# Altium schematic sheet main.SchDoc: Main
size A4; CheckedBy: rrodrigu; Author: Satxo; CompanyName: Satxo; Revision: 0v1; SheetNumber: 1; SheetTotal: 8; ProjectName: Basestation
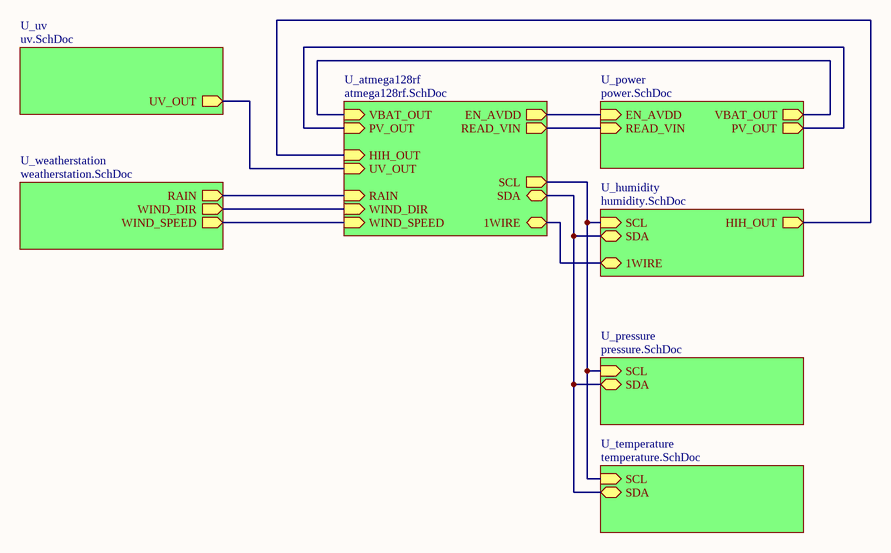
[diagram p0: main.SchDoc]

## Sub-sheets
U_atmega128rf = atmega128rf.SchDoc: SCL (out), SDA (bidir), HIH_OUT (in), PV_OUT (in), UV_OUT (in), VBAT_OUT (in), RAIN (in), WIND_DIR (in), WIND_SPEED (in), EN_AVDD (out), READ_VIN (out), 1WIRE (bidir)
U_humidity = humidity.SchDoc: HIH_OUT (out), SCL (in), SDA (bidir), 1WIRE (bidir)
U_power = power.SchDoc: PV_OUT (out), EN_AVDD (in), VBAT_OUT (out), READ_VIN (in)
U_pressure = pressure.SchDoc: SCL (in), SDA (bidir)
U_temperature = temperature.SchDoc: SCL (in), SDA (bidir)
U_uv = uv.SchDoc: UV_OUT (out)
U_weatherstation = weatherstation.SchDoc: RAIN (out), WIND_DIR (out), WIND_SPEED (out)

## Nets
(unnamed): sheet U_atmega128rf/SCL, sheet U_humidity/SCL, sheet U_pressure/SCL, sheet U_temperature/SCL
(unnamed): sheet U_atmega128rf/SDA, sheet U_humidity/SDA, sheet U_pressure/SDA, sheet U_temperature/SDA
(unnamed): sheet U_atmega128rf/HIH_OUT, sheet U_humidity/HIH_OUT
(unnamed): sheet U_atmega128rf/PV_OUT, sheet U_power/PV_OUT
(unnamed): sheet U_atmega128rf/UV_OUT, sheet U_uv/UV_OUT
(unnamed): sheet U_atmega128rf/VBAT_OUT, sheet U_power/VBAT_OUT
(unnamed): sheet U_atmega128rf/RAIN, sheet U_weatherstation/RAIN
(unnamed): sheet U_atmega128rf/WIND_DIR, sheet U_weatherstation/WIND_DIR
(unnamed): sheet U_atmega128rf/WIND_SPEED, sheet U_weatherstation/WIND_SPEED
(unnamed): sheet U_atmega128rf/EN_AVDD, sheet U_power/EN_AVDD
(unnamed): sheet U_atmega128rf/READ_VIN, sheet U_power/READ_VIN
(unnamed): sheet U_atmega128rf/1WIRE, sheet U_humidity/1WIRE

## Notes on the sheet
- Title
- Size:
- Date:
- A4
- Number:
- Time:
- Revision:
- Sheet
- of
- File: